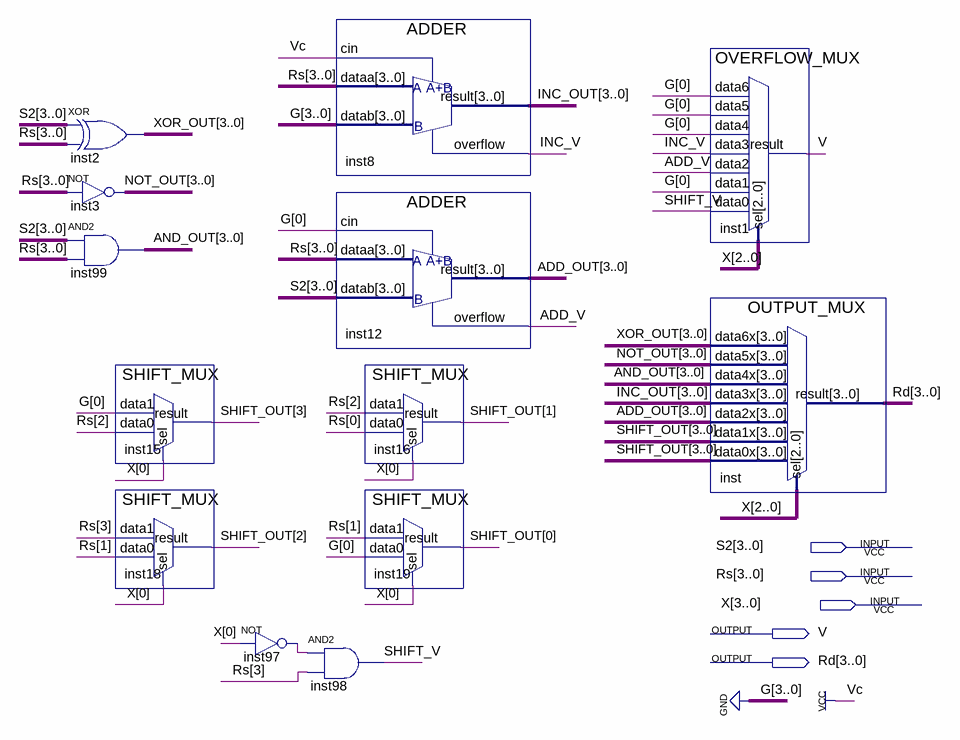
[diagram p0: schematic sheet]
// Quartus schematic 2020510034_Yusuf_group19_ALU.bdf as structural Verilog: 13 symbols, 5 pins
module \2020510034_Yusuf_group19_ALU  (
  input  [3:0] S2,
  input  [3:0] Rs,
  input  [3:0] X,
  output V,
  output [3:0] Rd
);

  wire ADD_V, INC_V, inst97_out, SHIFT_V;
  wire [3:0] ADD_OUT, AND_OUT, INC_OUT, NOT_OUT, SHIFT_OUT, XOR_OUT;

  assign XOR_OUT = S2 ^ Rs;  // XOR inst2, 4 bits wide
  assign NOT_OUT = ~Rs;  // NOT inst3, 4 bits wide
  assign AND_OUT = S2 & Rs;  // AND2 inst99, 4 bits wide
  SHIFT_MUX inst15 (.data1(1'b0), .data0(Rs[2]), .sel(X[0]), .result(SHIFT_OUT[3]));
  SHIFT_MUX inst18 (.data1(Rs[3]), .data0(Rs[1]), .sel(X[0]), .result(SHIFT_OUT[2]));
  not inst97 (inst97_out, X[0]);
  ADDER inst8 (.cin(1'b1), .dataa(Rs), .datab(4'b0000), .result(INC_OUT), .overflow(INC_V));
  ADDER inst12 (.cin(1'b0), .dataa(Rs), .datab(S2), .result(ADD_OUT), .overflow(ADD_V));
  SHIFT_MUX inst16 (.data1(Rs[2]), .data0(Rs[0]), .sel(X[0]), .result(SHIFT_OUT[1]));
  SHIFT_MUX inst19 (.data1(Rs[1]), .data0(1'b0), .sel(X[0]), .result(SHIFT_OUT[0]));
  and inst98 (SHIFT_V, inst97_out, Rs[3]);
  OVERFLOW_MUX inst1 (
    .data6(1'b0), .data5(1'b0), .data4(1'b0), .data3(INC_V), .data2(ADD_V), .data1(1'b0), .data0(SHIFT_V),
    .sel(X[2:0]), .result(V));
  OUTPUT_MUX inst (
    .data6x(XOR_OUT), .data5x(NOT_OUT), .data4x(AND_OUT), .data3x(INC_OUT), .data2x(ADD_OUT),
    .data1x(SHIFT_OUT), .data0x(SHIFT_OUT), .sel(X[2:0]), .result(Rd));
endmodule
